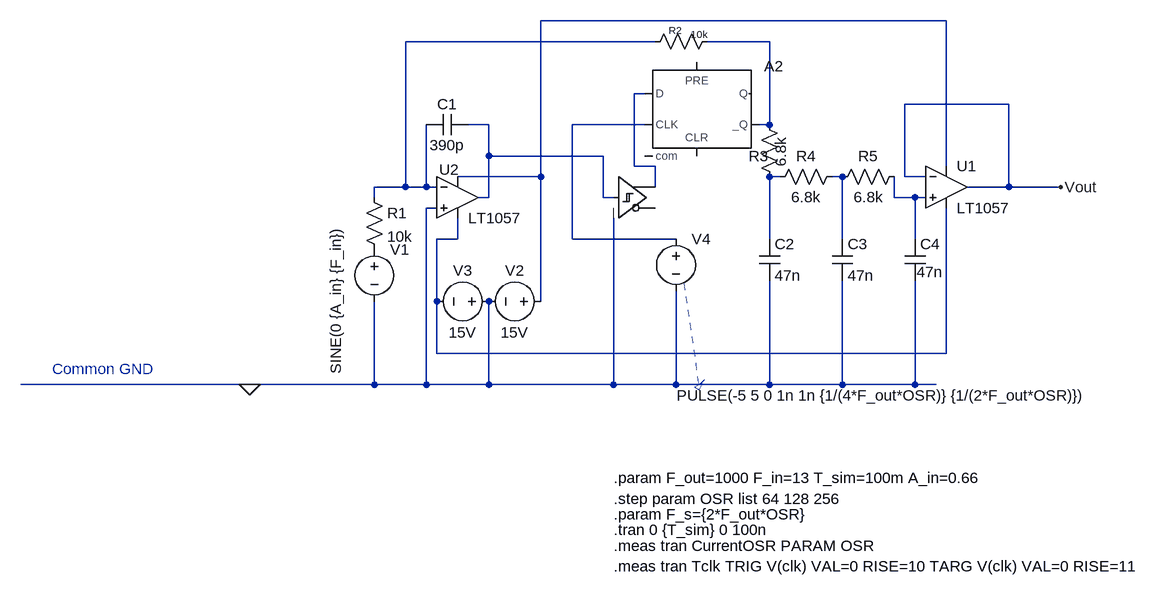
[diagram p0: schematic DeltaSigmaAnalogBreakdown.asc]
DeltaSigmaAnalogBreakdown.asc, the LTspice schematic file:
Version 4
SHEET 1 1444 856
WIRE 1168 0 544 0
WIRE 720 32 336 32
WIRE 896 32 800 32
WIRE 704 112 688 112
WIRE 1264 128 1104 128
WIRE 464 160 432 160
WIRE 704 160 592 160
WIRE 896 160 896 32
WIRE 896 160 880 160
WIRE 464 208 464 160
WIRE 640 208 464 208
WIRE 688 224 688 112
WIRE 720 224 688 224
WIRE 1168 224 1168 0
WIRE 544 240 544 0
WIRE 544 240 416 240
WIRE 912 240 896 240
WIRE 1008 240 992 240
WIRE 1104 240 1104 128
WIRE 1136 240 1104 240
WIRE 336 256 336 32
WIRE 336 256 288 256
WIRE 368 256 368 160
WIRE 368 256 336 256
WIRE 384 256 368 256
WIRE 720 256 720 224
WIRE 1264 256 1264 128
WIRE 1264 256 1200 256
WIRE 1344 256 1264 256
WIRE 288 272 288 256
WIRE 464 272 464 208
WIRE 464 272 448 272
WIRE 640 272 640 208
WIRE 656 272 640 272
WIRE 1088 272 1088 240
WIRE 1120 272 1088 272
WIRE 1136 272 1120 272
WIRE 384 288 368 288
WIRE 416 336 416 304
WIRE 416 336 384 336
WIRE 592 336 592 160
WIRE 752 336 592 336
WIRE 896 336 896 240
WIRE 1008 336 1008 240
WIRE 1120 336 1120 272
WIRE 384 432 384 336
WIRE 544 432 544 240
WIRE 384 512 384 432
WIRE 1168 512 1168 288
WIRE 1168 512 384 512
WIRE 96 560 -256 560
WIRE 288 560 288 432
WIRE 288 560 96 560
WIRE 368 560 368 288
WIRE 368 560 288 560
WIRE 464 560 464 432
WIRE 464 560 368 560
WIRE 656 560 656 304
WIRE 656 560 464 560
WIRE 752 560 752 416
WIRE 752 560 656 560
WIRE 896 560 896 400
WIRE 896 560 752 560
WIRE 1008 560 1008 400
WIRE 1008 560 896 560
WIRE 1120 560 1120 400
WIRE 1120 560 1008 560
WIRE 1152 560 1120 560
FLAG 96 560 0
FLAG 1344 256 Vout
SYMBOL res 272 256 R0
SYMATTR InstName R1
SYMATTR Value 10k
SYMBOL voltage 288 336 R0
WINDOW 123 -59 -19 VRight 2
SYMATTR Value2 SINE(0 {A_in} {F_in})
SYMATTR InstName V1
SYMATTR Value ""
SYMBOL cap 432 144 R90
WINDOW 0 0 32 VBottom 2
WINDOW 3 32 32 VTop 2
SYMATTR InstName C1
SYMATTR Value 390p
SYMBOL Digital/schmitt 656 208 R0
WINDOW 0 8 16 Invisible 2
WINDOW 3 8 120 Invisible 2
SYMATTR InstName A1
SYMATTR Value vhigh=1 vlow=-1
SYMBOL voltage 560 432 R90
WINDOW 0 -32 56 VBottom 2
WINDOW 3 32 56 VTop 2
SYMATTR InstName V2
SYMATTR Value 15V
SYMBOL voltage 480 432 R90
WINDOW 0 -32 56 VBottom 2
WINDOW 3 32 56 VTop 2
SYMATTR InstName V3
SYMATTR Value 15V
SYMBOL res 912 256 R180
WINDOW 0 17 48 Left 2
WINDOW 3 -1 31 VRight 2
SYMATTR InstName R3
SYMATTR Value 6.8k
SYMBOL res 1008 224 R90
WINDOW 0 0 56 VBottom 2
WINDOW 3 32 56 VTop 2
SYMATTR InstName R4
SYMATTR Value 6.8k
SYMBOL res 1104 224 R90
WINDOW 0 0 56 VBottom 2
WINDOW 3 32 56 VTop 2
SYMATTR InstName R5
SYMATTR Value 6.8k
SYMBOL cap 880 336 R0
SYMATTR InstName C2
SYMATTR Value 47n
SYMBOL cap 992 336 R0
SYMATTR InstName C3
SYMATTR Value 47n
SYMBOL cap 1104 336 R0
WINDOW 3 18 51 Left 2
SYMATTR Value 47n
SYMATTR InstName C4
SYMBOL Digital/dflop 784 64 R0
WINDOW 3 8 6 Invisible 2
SYMATTR Value vhigh=5 vlow=-5
SYMATTR InstName A2
SYMBOL res 816 16 R90
WINDOW 0 9 65 VBottom 1
WINDOW 3 -6 28 VTop 1
SYMATTR InstName R2
SYMATTR Value 10k
SYMBOL voltage 752 320 R0
WINDOW 3 1 257 Left 2
SYMATTR Value PULSE(-5 5 0 1n 1n {1/(4*F_out*OSR)} {1/(2*F_out*OSR)})
SYMATTR InstName V4
SYMBOL OpAmps/LT1057 416 208 R0
WINDOW 0 -28 21 Left 2
SYMATTR InstName U2
SYMBOL OpAmps/LT1057 1168 192 R0
SYMATTR InstName U1
TEXT 656 704 Left 2 !.param F_out=1000 F_in=13 T_sim=100m A_in=0.66
TEXT 656 736 Left 2 !.step param OSR list 64 128 256
TEXT 656 760 Left 2 !.param F_s={2*F_out*OSR}
TEXT 656 784 Left 2 !.tran 0 {T_sim} 0 100n
TEXT -208 536 Left 2 ;Common GND
TEXT 656 808 Left 2 !.meas tran CurrentOSR PARAM OSR
TEXT 656 840 Left 2 !.meas tran Tclk TRIG V(clk) VAL=0 RISE=10 TARG V(clk) VAL=0 RISE=11
LINE Normal 764 404 788 568 2
LINE Normal 780 564 788 568 2
LINE Normal 788 568 792 560 2
LINE Normal 780 564 788 560 2
LINE Normal 788 560 792 556 2
LINE Normal 792 556 796 552 2
LINE Normal 792 560 792 556 2

The netlist it stands for:
* DeltaSigmaAnalogBreakdown.asc
R1 N002 P001 10k
V1 P001 0 SINE(0 {A_in} {F_in})
C1 N005 N002 390p
A1 N005 0 0 0 0 0 N004 0 SCHMITT vhigh=1 vlow=-1
V2 N001 0 15V
V3 0 N010 15V
R3 N007 N003 6.8k
R4 N008 N007 6.8k
R5 N009 N008 6.8k
C2 N007 0 47n
C3 N008 0 47n
C4 N009 0 47n
A2 N004 0 N006 0 0 N003 0 0 DFLOP vhigh=5 vlow=-5
R2 N003 N002 10k
V4 N006 0 PULSE(-5 5 0 1n 1n {1/(4*F_out*OSR)} {1/(2*F_out*OSR)})
XU2 0 N002 N001 N010 N005 LT1057  ; pins In+ In- V+ V- OUT
XU1 N009 Vout N001 N010 Vout LT1057  ; pins In+ In- V+ V- OUT
.param F_out=1000 F_in=13 T_sim=100m A_in=0.66
.step param OSR list 64 128 256
.param F_s={2*F_out*OSR}
.tran 0 {T_sim} 0 100n
* Common GND
.meas tran CurrentOSR PARAM OSR
.meas tran Tclk TRIG V(clk) VAL=0 RISE=10 TARG V(clk) VAL=0 RISE=11
.lib LTC.lib
.backanno
.end